# EAGLE schematic enzi_rev3 (EAGLE 6.5.0)
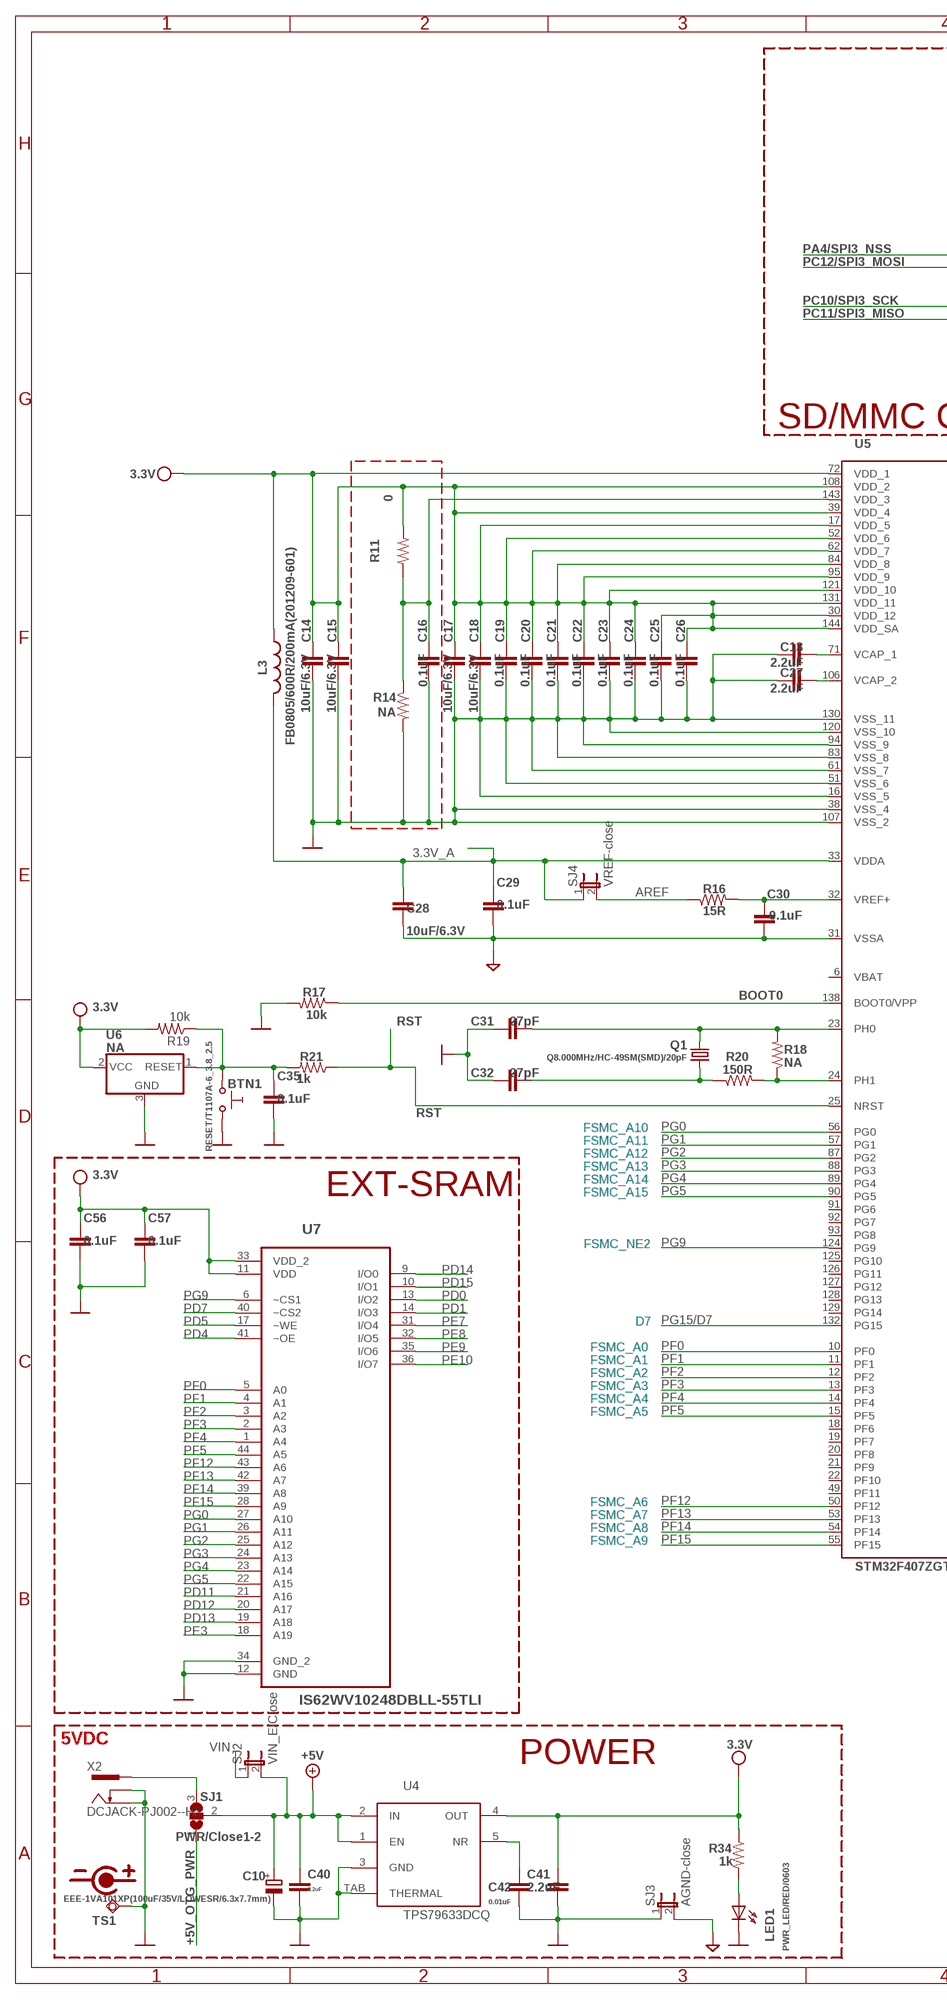
[diagram p0: schematic, sheet 1, part 1 of 2]
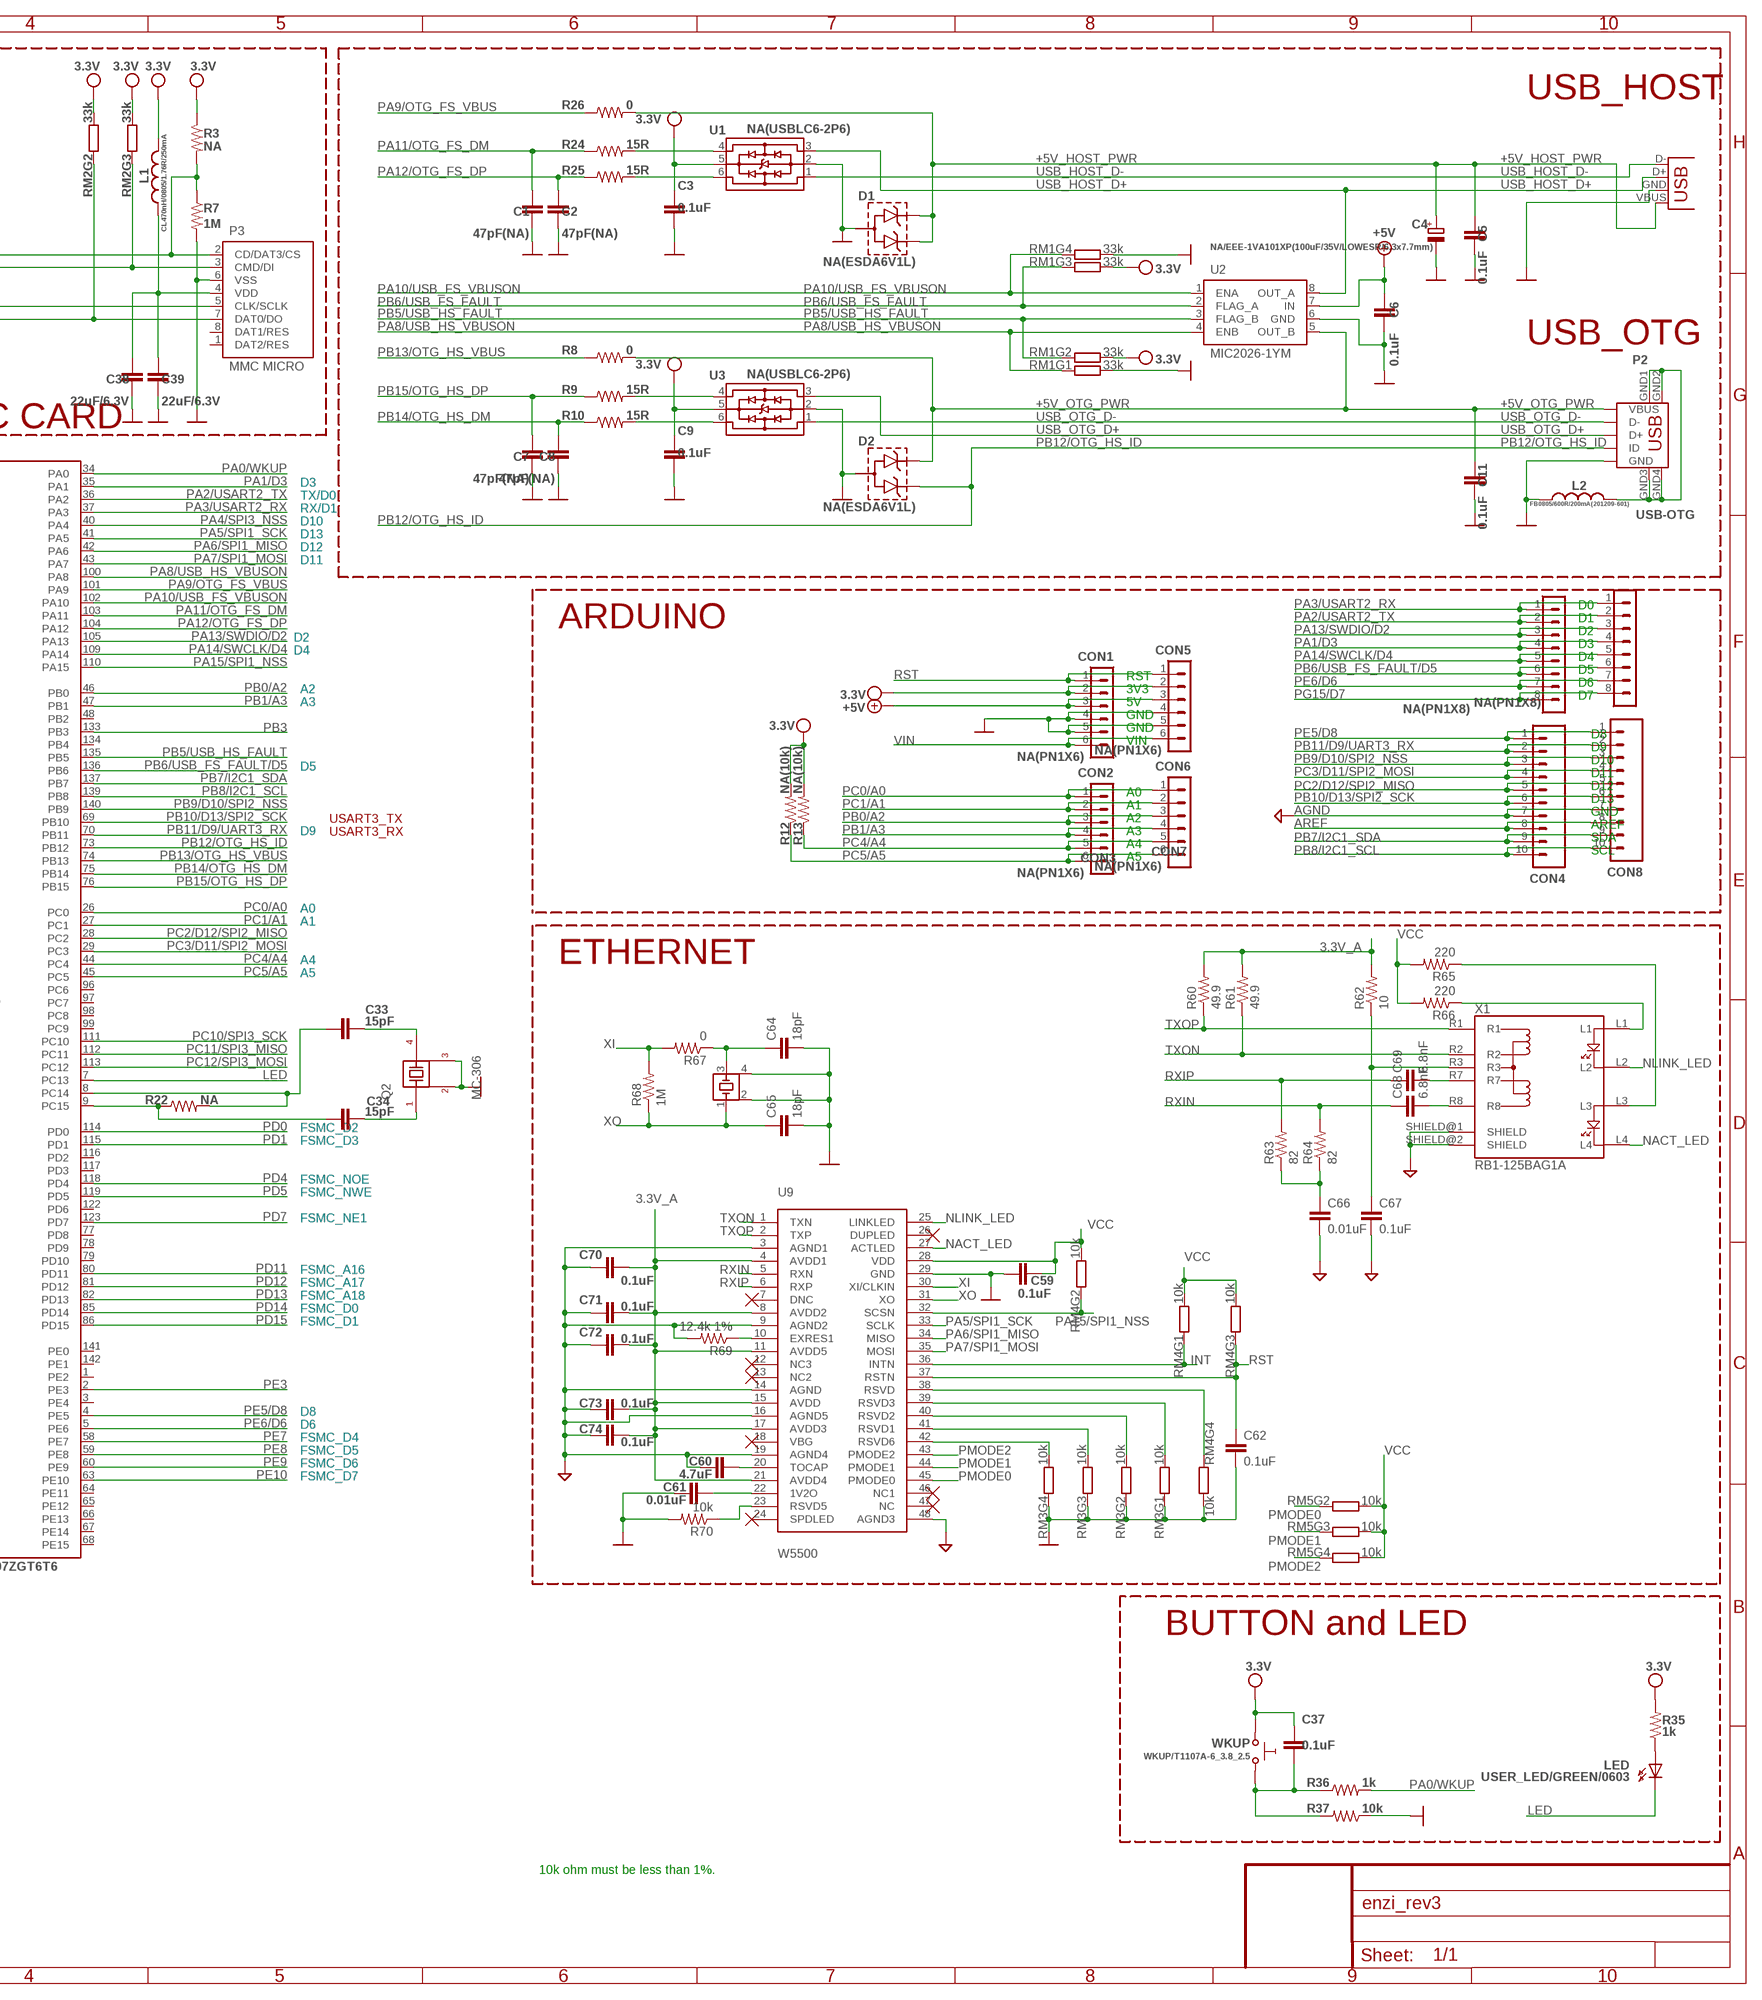
[diagram p1: schematic, sheet 1, part 2 of 2]

## Parts
BTN1  RESET/T1107A-6_3.8_2.5  SW-TAKT6  [SW-TAKT_6X3.5_SMD]
C1  47pF(NA)  CAP0603-CAP  [0603-CAP]
C2  47pF(NA)  CAP0603-CAP  [0603-CAP]
C3  0.1uF  CAP0603-CAP  [0603-CAP]
C4  NA/EEE-1VA101XP(100uF/35V/LOWESR/6.3x7.7mm)  CPOL-EUD  [PANASONIC_D]
C5  0.1uF  CAP0603-CAP  [0603-CAP]
C6  0.1uF  CAP0603-CAP  [0603-CAP]
C7  47pF(NA)  CAP0603-CAP  [0603-CAP]
C8  47pF(NA)  CAP0603-CAP  [0603-CAP]
C9  0.1uF  CAP0603-CAP  [0603-CAP]
C10  EEE-1VA101XP(100uF/35V/LOWESR/6.3x7.7mm)  CPOL-EUD  [PANASONIC_D]
C11  0.1uF  CAP0603-CAP  [0603-CAP]
C13  2.2uF  CAP0603-CAP  [0603-CAP]
C14  10uF/6.3V  CAP0603-CAP  [0603-CAP]
C15  10uF/6.3V  CAP0603-CAP  [0603-CAP]
C16  0.1uF  CAP0603-CAP  [0603-CAP]
C17  10uF/6.3V  CAP0603-CAP  [0603-CAP]
C18  10uF/6.3V  CAP0603-CAP  [0603-CAP]
C19  0.1uF  CAP0603-CAP  [0603-CAP]
C20  0.1uF  CAP0603-CAP  [0603-CAP]
C21  0.1uF  CAP0603-CAP  [0603-CAP]
C22  0.1uF  CAP0603-CAP  [0603-CAP]
C23  0.1uF  CAP0603-CAP  [0603-CAP]
C24  0.1uF  CAP0603-CAP  [0603-CAP]
C25  0.1uF  CAP0603-CAP  [0603-CAP]
C26  0.1uF  CAP0603-CAP  [0603-CAP]
C27  2.2uF  CAP0603-CAP  [0603-CAP]
C28  10uF/6.3V  CAP0603-CAP  [0603-CAP]
C29  0.1uF  CAP0603-CAP  [0603-CAP]
C30  0.1uF  CAP0603-CAP  [0603-CAP]
C31  27pF  CAP0603-CAP  [0603-CAP]
C32  27pF  CAP0603-CAP  [0603-CAP]
C33  15pF  CAP0603-CAP  [0603-CAP]
C34  15pF  CAP0603-CAP  [0603-CAP]
C35  0.1uF  CAP0603-CAP  [0603-CAP]
C37  0.1uF  CAP0603-CAP  [0603-CAP]
C38  22uF/6.3V  CAP0603-CAP  [0603-CAP]
C39  22uF/6.3V  CAP0603-CAP  [0603-CAP]
C40  2.2uF  CAP0603-CAP  [0603-CAP]
C41  2.2uF  CAP0603-CAP  [0603-CAP]
C42  0.01uF  CAP0603-CAP  [0603-CAP]
C56  0.1uF  CAP0603-CAP  [0603-CAP]
C57  0.1uF  CAP0603-CAP  [0603-CAP]
C59  0.1uF  CAP0603-CAP  [0603-CAP]
C60  4.7uF  CAP0603-CAP  [0603-CAP]
C61  0.01uF  CAP0603-CAP  [0603-CAP]
C62  0.1uF  CAP0603-CAP  [0603-CAP]
C64  18pF  CAP0603-CAP  [0603-CAP]
C65  18pF  CAP0603-CAP  [0603-CAP]
C66  0.01uF  CAP0603-CAP  [0603-CAP]
C67  0.1uF  CAP0603-CAP  [0603-CAP]
C68  6.8nF  CAP0603-CAP  [0603-CAP]
C69  6.8nF  CAP0603-CAP  [0603-CAP]
C70  0.1uF  CAP0603-CAP  [0603-CAP]
C71  0.1uF  CAP0603-CAP  [0603-CAP]
C72  0.1uF  CAP0603-CAP  [0603-CAP]
C73  0.1uF  CAP0603-CAP  [0603-CAP]
C74  0.1uF  CAP0603-CAP  [0603-CAP]
CON1  NA(PN1X6)  CON6PN1X6  [PN1X6]
CON2  NA(PN1X6)  CON6PN1X6  [PN1X6]
CON3  NA(PN1X8)  CON8PN1X8  [PN1X8]
CON4  M10"  [1X10]
CON5  NA(PN1X6)  CON6PN1X6  [PN1X6]
CON6  NA(PN1X6)  CON6PN1X6  [PN1X6]
CON7  NA(PN1X8)  CON8PN1X8  [PN1X8]
CON8  M10"  [1X10]
D1  NA(ESDA6V1L)  MMBZ5V6ALT1  [SOT-23]
D2  NA(ESDA6V1L)  MMBZ5V6ALT1  [SOT-23]
L1  CL470nH/0805/1.76R/250mA  L-USL2012C  [L2012C]
L2  FB0805/600R/200mA(201209-601)  L-USL2012C  [L2012C]
L3  FB0805/600R/200mA(201209-601)  L-USL2012C  [L2012C]
LED  USER_LED/GREEN/0603  LED0603DWS  [LED-0603]
LED1  PWR_LED/RED/0603  LED0603DWS  [LED-0603]
P2  USB-OTG  MINI_USB9  [USB_MINI_9PIN]
P3  MMC MICRO  MICRO_SD/MMC  [TFR-MEM-CON]
Q1  Q8.000MHz/HC-49SM(SMD)/20pF  HC49/S1  [HC49/SMD2_THIN]
Q2  MC-306  [4-SOJ]
Q3  25MHz/18pf  ABM3C-25.000MHZ-D4Y-T  [ABRACON_CRYSTAL_5.0X3.2MM]
R3  NA  RESISTOR0603-RES  [0603-RES]
R7  1M  RESISTOR0603-RES  [0603-RES]
R8  0  RESISTOR0603-RES  [0603-RES]
R9  15R  RESISTOR0603-RES  [0603-RES]
R10  15R  RESISTOR0603-RES  [0603-RES]
R11  0  RESISTOR0603-RES  [0603-RES]
R12  NA(10k)  RESISTOR0603-RES  [0603-RES]
R13  NA(10k)  RESISTOR0603-RES  [0603-RES]
R14  NA  RESISTOR0603-RES  [0603-RES]
R16  15R  RESISTOR0603-RES  [0603-RES]
R17  10k  RESISTOR0603-RES  [0603-RES]
R18  NA  RESISTOR0603-RES  [0603-RES]
R19  10k  RESISTOR0603-RES  [0603-RES]
R20  150R  RESISTOR0603-RES  [0603-RES]
R21  1k  RESISTOR0603-RES  [0603-RES]
R22  NA  RESISTOR0603-RES  [0603-RES]
R24  15R  RESISTOR0603-RES  [0603-RES]
R25  15R  RESISTOR0603-RES  [0603-RES]
R26  0  RESISTOR0603-RES  [0603-RES]
R34  1k  RESISTOR0603-RES  [0603-RES]
R35  1k  RESISTOR0603-RES  [0603-RES]
R36  1k  RESISTOR0603-RES  [0603-RES]
R37  10k  RESISTOR0603-RES  [0603-RES]
R60  49.9  RESISTOR0603-RES  [0603-RES]
R61  49.9  RESISTOR0603-RES  [0603-RES]
R62  10  RESISTOR0603-RES  [0603-RES]
R63  82  RESISTOR0603-RES  [0603-RES]
R64  82  RESISTOR0603-RES  [0603-RES]
R65  220  RESISTOR0603-RES  [0603-RES]
R66  220  RESISTOR0603-RES  [0603-RES]
R67  0  RESISTOR0603-RES  [0603-RES]
R68  1M  RESISTOR0603-RES  [0603-RES]
R69  12.4k 1%  RESISTOR0603-RES  [0603-RES]
R70  10k  RESISTOR0603-RES  [0603-RES]
RM1  33k  R_MATRIX_4E  [R_MATRIX_4]
RM2  33k  R_MATRIX_4E  [R_MATRIX_4]
RM3  10k  R_MATRIX_4E  [R_MATRIX_4]
RM4  10k  R_MATRIX_4E  [R_MATRIX_4]
RM5  10k  R_MATRIX_4E  [R_MATRIX_4]
SJ1  PWR/Close1-2  SJ2W  [SJ_2]
SJ2  VIN_E/Close  JUMPER-2SMD-NC  [SJ_2S]
SJ3  AGND-close  JUMPER-2SMD-NC  [SJ_2S]
SJ4  VREF-close  JUMPER-2SMD-NC  [SJ_2S]
TS1  TESTPAD3  [TEST_PAD40/70/SQUARE]
U1  NA(USBLC6-2P6)  USBLC6-2  [USBLC6-2P6]
U2  MIC2026-1YM  [SO-8]
U3  NA(USBLC6-2P6)  USBLC6-2  [USBLC6-2P6]
U4  TPS79633DCQ  [SOT223-5]
U5  STM32F407ZGT6T6  [LQFP144]
U6  NA  RESETMCP130T-300-I/TT  [SOT23]
U7  IS62WV10248DBLL-55TLI  [SOP80P1176X120-44N]
U9  W5500  [48LQFP]
WKUP  WKUP/T1107A-6_3.8_2.5  SW-TAKT6  [SW-TAKT_6X3.5_SMD]
X1  RB1-125BAG1A  [RB1-125BAG1A]
X2  DCJACK-PJ002--H3  [PJ-002--H3]
X3  USB-A-HU  [USB-A-HU]

## Nets
3.3V_A: C28.1 C29.2 C70.2 C71.2 C72.2 C73.2 C74.2 L3.2 R60.2 R61.2 R62.2 SJ4.1 U5.33(VDDA) U9.4(AVDD1) U9.8(AVDD2) U9.11(AVDD5) U9.15(AVDD) U9.17(AVDD3) U9.21(AVDD4)
+5V: C6.1 C10.+ C40.1 CON1.3 CON5.3 SJ1.2 SJ2.2 U2.7(IN) U4.1(EN) U4.2(IN)
+5V_HOST_PWR: C4.+ C5.1 D1.1 D1.2 R26.2 X3.VBUS(GND)
+5V_OTG_PWR: C11.1 D2.1 P2.VBUS R8.2 SJ1.1 U2.5(OUT_B)
AGND: C28.2 C29.1 C30.1 C60.1 C66.2 C67.2 C70.1 C71.1 C72.1 C73.1 C74.1 CON4.7 CON8.7 R69.2 SJ3.2 U5.31(VSSA) U9.3(AGND1) U9.9(AGND2) U9.14(AGND) U9.16(AGND5) U9.19(AGND4) U9.48(AGND3) X1.SHIELD@1(SHIELD) X1.SHIELD@2(SHIELD)
AREF: CON4.8 CON8.8 R16.1 SJ4.2
BOOT0: R17.1 U5.138(BOOT0/VPP)
EXRES2: R69.1 U9.10(EXRES1)
GND [PWR]: BTN1.P$2 C1.2 C2.2 C3.1 C4.- C5.2 C6.2 C7.2 C8.2 C9.1 C10.- C11.2 C13.1 C14.1 C15.1 C16.1 C17.1 C18.1 C19.1 C20.1 C21.1 C22.1 C23.1 C24.1 C25.1 C26.1 C27.1 C31.2 C32.2 C35.1 C38.2 C39.2 C40.2 C41.2 C42.2 C56.1 C57.1 C59.2 C61.1 C62.2 C64.2 C65.2 CON1.4 CON1.5 CON5.4 CON5.5 D1.3 D2.3 L2.1 LED1.C P2.GND P3.6(VSS) Q2.2 Q2.3 Q3.2 Q3.4 R7.2 R14.2 R17.2 R37.1 R70.2 RM1.1.2 RM1.4.2 RM3.1.1 RM3.2.1 RM3.3.1 RM3.4.1 RM4.4.2 SJ3.1 TS1.P$1(PP) U1.2 U2.6(GND) U3.2 U4.3(GND) U4.TAB(THERMAL) U5.16(VSS_5) U5.38(VSS_4) U5.51(VSS_6) U5.61(VSS_7) U5.83(VSS_8) U5.94(VSS_9) U5.107(VSS_2) U5.120(VSS_10) U5.130(VSS_11) U6.3(GND) U7.12(GND) U7.34(GND_2) U9.29(GND) X2.2 X2.3 X3.GND(VBUS)
INT: RM4.1.1 U9.36(INTN)
L1: R66.1 X1.L1
L3: R65.1 X1.L3
LED: LED.C U5.7(PC13)
N$1: C31.1 Q1.2 R18.2 U5.23(PH0)
N$2: C32.1 Q1.1 R20.1
N$3: R18.1 R20.2 U5.24(PH1)
N$4: C69.2 X1.R7
N$5: LED.A R35.1
N$6: C68.2 X1.R8
N$7: C67.1 R62.1 X1.R3
N$10: R24.2 U1.4
N$11 [PWR]: C34.2 Q2.1
N$12 [PWR]: C66.1 R63.1 R64.1
N$13: C33.2 Q2.4
N$14: C64.1 Q3.3 R67.1
N$18: RM3.1.2 U9.39(RSVD3)
N$19: RM3.2.2 U9.40(RSVD2)
N$20: RM3.3.2 U9.41(RSVD1)
N$21: RM3.4.2 U9.42(RSVD6)
N$22: RM4.4.1 U9.38(RSVD)
N$23: C60.2 U9.20(TOCAP)
N$24 [PWR]: C42.1 U4.5(NR)
N$25: C37.1 R36.1 R37.2 WKUP.P$2
N$26: C61.2 U9.22(1V2O)
N$27: R70.1 U9.23(RSVD5)
N$31: R25.2 U1.6
N$37: SJ1.3 X2.1
N$41: R9.2 U3.4
N$43: R10.2 U3.6
N$78: C38.1 C39.1 L1.2 P3.4(VDD)
N$117: C13.2 U5.71(VCAP_1)
N$128: C27.2 U5.106(VCAP_2)
N$129: LED1.A R34.2
N$163: BTN1.P$1 C35.2 R19.1 R21.2 U6.1(RESET)
N$470: C16.2 R11.1 R14.1 U5.143(VDD_3)
NACT_LED: U9.27(ACTLED) X1.L4
NLINK_LED: U9.25(LINKLED) X1.L2
PA0/WKUP: R36.2 U5.34(PA0)
PA1/D3: CON3.4 CON7.4 U5.35(PA1)
PA2/USART2_TX [thin]: CON3.2 CON7.2 U5.36(PA2)
PA3/USART2_RX: CON3.1 CON7.1 U5.37(PA3)
PA4/SPI3_NSS: P3.2(CD/DAT3/CS) R3.2 R7.1 U5.40(PA4)
PA5/SPI1_SCK: U5.41(PA5) U9.33(SCLK)
PA6/SPI1_MISO: U5.42(PA6) U9.34(MISO)
PA7/SPI1_MOSI: U5.43(PA7) U9.35(MOSI)
PA8/USB_HS_VBUSON: RM1.1.1 U2.4(ENB) U5.100(PA8)
PA9/OTG_FS_VBUS: R26.1 U5.101(PA9)
PA10/USB_FS_VBUSON: RM1.4.1 U2.1(ENA) U5.102(PA10)
PA11/OTG_FS_DM: C1.1 R24.1 U5.103(PA11)
PA12/OTG_FS_DP: C2.1 R25.1 U5.104(PA12)
PA13/SWDIO/D2: CON3.3 CON7.3 U5.105(PA13)
PA14/SWCLK/D4: CON3.5 CON7.5 U5.109(PA14)
PA15/SPI1_NSS: RM4.2.1 U5.110(PA15) U9.32(SCSN)
PB0/A2: CON2.3 CON6.3 U5.46(PB0)
PB1/A3: CON2.4 CON6.4 U5.47(PB1)
PB3: U5.133(PB3)
PB5/USB_HS_FAULT: RM1.2.1 U2.3(FLAG_B) U5.135(PB5)
PB6/USB_FS_FAULT: RM1.3.1 U2.2(FLAG_A)
PB6/USB_FS_FAULT/D5: CON3.6 CON7.6 U5.136(PB6)
PB7/I2C1_SDA: CON4.9 CON8.9 U5.137(PB7)
PB8/I2C1_SCL: CON4.10 CON8.10 U5.139(PB8)
PB9/D10/SPI2_NSS: CON4.3 CON8.3 U5.140(PB9)
PB10/D13/SPI2_SCK: CON4.6 CON8.6 U5.69(PB10)
PB11/D9/UART3_RX: CON4.2 CON8.2 U5.70(PB11)
PB12/OTG_HS_ID: D2.2 P2.ID U5.73(PB12)
PB13/OTG_HS_VBUS: R8.1 U5.74(PB13)
PB14/OTG_HS_DM: C8.1 R10.1 U5.75(PB14)
PB15/OTG_HS_DP: C7.1 R9.1 U5.76(PB15)
PC0/A0: CON2.1 CON6.1 U5.26(PC0)
PC1/A1: CON2.2 CON6.2 U5.27(PC1)
PC2/D12/SPI2_MISO: CON4.5 CON8.5 U5.28(PC2)
PC3/D11/SPI2_MOSI: CON4.4 CON8.4 U5.29(PC3)
PC4/A4: CON2.5 CON6.5 R13.1 U5.44(PC4)
PC5/A5: CON2.6 CON6.6 R12.1 U5.45(PC5)
PC10/SPI3_SCK: P3.5(CLK/SCLK) U5.111(PC10)
PC11/SPI3_MISO: P3.7(DAT0/DO) RM2.2.1 U5.112(PC11)
PC12/SPI3_MOSI: P3.3(CMD/DI) RM2.3.1 U5.113(PC12)
PC14: C33.1 R22.2 U5.8(PC14)
PC15: C34.1 R22.1 U5.9(PC15)
PD0: U5.114(PD0) U7.13(I/O2)
PD1 [thin]: U5.115(PD1) U7.14(I/O3)
PD4: U5.118(PD4) U7.41(~OE)
PD5: U5.119(PD5) U7.17(~WE)
PD7: U5.123(PD7) U7.40(~CS2)
PD11 [thin]: U5.80(PD11) U7.21(A16)
PD12 [thin]: U5.81(PD12) U7.20(A17)
PD13: U5.82(PD13) U7.19(A18)
PD14: U5.85(PD14) U7.9(I/O0)
PD15 [thin]: U5.86(PD15) U7.10(I/O1)
PE3: U5.2(PE3) U7.18(A19)
PE5/D8: CON4.1 CON8.1 U5.4(PE5)
PE6/D6: CON3.7 CON7.7 U5.5(PE6)
PE7 [thin]: U5.58(PE7) U7.31(I/O4)
PE8 [thin]: U5.59(PE8) U7.32(I/O5)
PE9: U5.60(PE9) U7.35(I/O6)
PE10: U5.63(PE10) U7.36(I/O7)
PF0: U5.10(PF0) U7.5(A0)
PF1: U5.11(PF1) U7.4(A1)
PF2: U5.12(PF2) U7.3(A2)
PF3: U5.13(PF3) U7.2(A3)
PF4: U5.14(PF4) U7.1(A4)
PF5 [thin]: U5.15(PF5) U7.44(A5)
PF12 [thin]: U5.50(PF12) U7.43(A6)
PF13 [thin]: U5.53(PF13) U7.42(A7)
PF14 [thin]: U5.54(PF14) U7.39(A8)
PF15: U5.55(PF15) U7.28(A9)
PG0 [thin]: U5.56(PG0) U7.27(A10)
PG1 [thin]: U5.57(PG1) U7.26(A11)
PG2: U5.87(PG2) U7.25(A12)
PG3: U5.88(PG3) U7.24(A13)
PG4 [thin]: U5.89(PG4) U7.23(A14)
PG5 [thin]: U5.90(PG5) U7.22(A15)
PG9: U5.124(PG9) U7.6(~CS1)
PG15/D7: CON3.8 CON7.8 U5.132(PG15)
PMODE0: RM5.2.1 U9.45(PMODE0)
PMODE1: RM5.3.1 U9.44(PMODE1)
PMODE2: RM5.4.1 U9.43(PMODE2)
RST: C62.1 CON1.1 CON5.1 R21.1 RM4.3.1 U5.25(NRST) U9.37(RSTN)
RXIN: C68.1 R64.2 U9.5(RXN)
RXIP: C69.1 R63.2 U9.6(RXP)
TXON: R61.1 U9.1(TXN) X1.R2
TXOP: R60.1 U9.2(TXP) X1.R1
USB_HOST_D+: U1.3 U2.8(OUT_A) X3.D+(D-)
USB_HOST_D-: U1.1 X3.D-(D+)
USB_OTG_D+: P2.D+ U3.3
USB_OTG_D-: P2.D- U3.1
USB_SHIELD: L2.2 P2.GND1 P2.GND2 P2.GND3 P2.GND4
VCC [PWR]: C3.2 C9.2 C14.2 C15.2 C17.2 C18.2 C19.2 C20.2 C21.2 C22.2 C23.2 C24.2 C25.2 C26.2 C37.2 C41.1 C56.2 C57.2 C59.1 CON1.2 CON5.2 L1.1 L3.1 R3.1 R11.2 R12.2 R13.2 R19.2 R34.1 R35.2 R65.2 R66.2 RM1.2.2 RM1.3.2 RM2.2.2 RM2.3.2 RM4.1.2 RM4.2.2 RM4.3.2 RM5.2.2 RM5.3.2 RM5.4.2 U1.5 U3.5 U4.4(OUT) U5.17(VDD_5) U5.30(VDD_12) U5.39(VDD_4) U5.52(VDD_6) U5.62(VDD_7) U5.72(VDD_1) U5.84(VDD_8) U5.95(VDD_9) U5.108(VDD_2) U5.121(VDD_10) U5.131(VDD_11) U5.144(VDD_SA) U6.2(VCC) U7.11(VDD) U7.33(VDD_2) U9.28(VDD) WKUP.P$1 ; supply symbol labelled 3.3V
VIN: CON1.6 CON5.6 SJ2.1
VREF+: C30.2 R16.2 U5.32(VREF+)
XI: R67.2 R68.2 U9.30(XI/CLKIN)
XO: C65.1 Q3.1 R68.1 U9.31(XO)
Unconnected: P3.1(DAT2/RES) P3.8(DAT1/RES) RM2.1.1 RM2.1.2 RM2.4.1 RM2.4.2 RM5.1.1 RM5.1.2 U5.1(PE2) U5.3(PE4) U5.18(PF6) U5.19(PF7) U5.20(PF8) U5.21(PF9) U5.22(PF10) U5.48(PB2) U5.49(PF11) U5.64(PE11) U5.65(PE12) U5.66(PE13) U5.67(PE14) U5.68(PE15) U5.77(PD8) U5.78(PD9) U5.79(PD10) U5.91(PG6) U5.92(PG7) U5.93(PG8) U5.96(PC6) U5.97(PC7) U5.98(PC8) U5.99(PC9) U5.116(PD2) U5.117(PD3) U5.122(PD6) U5.125(PG10) U5.126(PG11) U5.127(PG12) U5.128(PG13) U5.129(PG14) U5.134(PB4) U5.141(PE0) U5.142(PE1) U9.7(DNC) U9.12(NC3) U9.13(NC2) U9.18(VBG) U9.24(SPDLED) U9.26(DUPLED) U9.46(NC1) U9.47(NC)

## Notes on the sheet
- USB_HOST
- USB_OTG
- SD/MMC CARD
- D3
- TX/D0
- RX/D1
- D10
- D13
- D12
- D11
- D0
- D1
- ARDUINO
- D2
- D2
- D3
- D4
- D4
- D5
- RST
- D6
- A2 | 3V3
- D7
- A3 | 5V
- GND
- GND
- D8
- VIN
- D9
- D10
- D5
- D11
- D12
- A0
- D13
- A1
- GND
- USART3_TX | A2
- AREF
- D9 | USART3_RX | A3
- SDA
- A4
- SCL
- A5
- A0
- A1
- A4 | ETHERNET
- A5
- FSMC_A10 | FSMC_D2
- FSMC_A11 | FSMC_D3
- FSMC_A12
- FSMC_A13
- FSMC_A14 | FSMC_NOE
- EXT-SRAM | FSMC_A15 | FSMC_NWE
- FSMC_NE1
- FSMC_NE2
- FSMC_A16
- FSMC_A17
- FSMC_A18
- FSMC_D0
- D7 | FSMC_D1
- FSMC_A0
- FSMC_A1
- FSMC_A2
- FSMC_A3
- FSMC_A4
- FSMC_A5 | D8
- D6
- FSMC_D4
- FSMC_D5
- FSMC_D6
- FSMC_D7
- FSMC_A6
- FSMC_A7
- FSMC_A8
- FSMC_A9
- BUTTON and LED
- 5VDC
- POWER
- 10k ohm must be less than 1%.

## Power pins joined to a net without a drawn wire
VBAT: U5.6(VBAT)

## Library data of the parts
BTN1 WKUP = gogo:SW-TAKT
C1-C3 C5-C9 C11 C13-C35 C37-C42 C56 C57 C59-C62 C64-C74 = SparkFun:CAP: Capacitor Standard 0603 ceramic capacitor, and 0.1" leaded capacitor.
C4 C10 = rcl:CPOL-EU: POLARIZED CAPACITOR, European symbol
CON1 CON2 CON5 CON6 = Penko:CON6: CONNECTORS - 6 PINS
CON3 CON7 = Penko:CON8
CON4 CON8 = SparkFun:M10: Header 10 Standard 10-pin 0.1" header. Use with straight break away headers (SKU : PRT-00116), right angle break away headers (PRT-00553), swiss pins (PRT-00743), machine pins (PRT-00117), and female headers (PRT-00115).
D1 D2 = OLIMEX_DISCRET:MMBZ5V6ALT1
L1-L3 = rcl:L-US: INDUCTOR, American symbol
LED LED1 = DOUBLE-SIDE:LED
P2 = OLIMEX_CONNECTORS:MINI_USB9
P3 = OLIMEX_CONNECTORS:MICRO_SD/MMC
Q1 = crystal:HC49/S: CRYSTAL
Q2 = manycolors:MC-306
Q3 = manycolors:ABM3C-25.000MHZ-D4Y-T
R3 R7-R14 R16-R22 R24-R26 R34-R37 R60-R70 = SparkFun:RESISTOR: Resistor Basic schematic elements and footprints for 0603, 1206, and PTH 1/10th watt (small) resistors.
RM1-RM5 = OLIMEX_DISCRET:R_MATRIX_4E
SJ1 = jumper:SJ2W: SMD solder JUMPER
SJ2-SJ4 = SparkFun:JUMPER-2: Jumper Basic 0.1" spaced jumper. Use with breakaway headers.
TS1 = gogo:TESTPAD: drill 40mils, diameter 70mils
U1 U3 = OLIMEX_IC:USBLC6-2
U2 = OLIMEX_IC:MIC2026: LM3526 Dual Port USB Power Switch and Over-Current Protection Features: -> Compatible with USB1.1 and USB2.0; -> 1 ms fault flag delay filters Hot-Plug events; -> Smooth turn-on eliminates in-rush induced voltage drop; -> UL recognized component: REF#205202; -> 1A nominal shortcircuit output current protects PC power supplies; -> Thermal shutdown protects device in direct short condition; -> 500mA minimum continuous load current; -> Small SO-8 package minimizes board space; -> 2.7V to 5.5V input voltage range; -> 140mOhm Max.switch resistance; -> 1 µA Max. standby current; -> 200µA Max. operating current; -> Under-voltage lockout(UVLO);
U4 = manycolors:TPS79633DCQ
U5 = OLIMEX_IC:STM32F407ZGT6: STM32F407ZGT6 ARM-based 32-bit MCU, 150DMIPs, up to 1 MB Flash/192KB RAM,USB OTG HS/FS, Ethernet, 17 TIMs, 3 ADCs, 15 comm. interfaces & camera
U6 = gogo:RESET: Microcontroller Supervisory Circuit with Open Drain Output
U7 = ISSI_By_element14_Batch_1:IS62WV10248DBLL-55TLI; MPN: IS62WV10248DBLL-55TLI; SUPPLIER: INTEGRATED SILICON SOLUTION (ISSI)
U9 = manycolors:W5500
X1 = Rob's Library:RB1-125BAG1A: MagJack RB1-125BAG1A
X2 = kamiki-dcjack:DCJACK: DC JACK 2.1mmφ - 5.5mmφ DCジャック、基板用。
X3 = con-usb:USB: USB Connectors

## Net classes
1 PWR: width 0.203 mm, drill 0.4 mm, clearance 0.076 mm
2 thin: width 0.025 mm, clearance 0.025 mm
3 gsm_pwr: width 0.914 mm, drill 0.787 mm